# Altium schematic sheet 1_PD 20V 5A.schdoc
size 307 x 218 mm; Symbol: Drawing-Symbol_A4; Device: Drawing-Symbol_A4; @Project Name: PowerManagement Board for Rpi; @Page Count: 1; @Update Date: 2025-02-01; @Create Date: 2024-12-30; @Schematic Name: Rpi Head; @Page No: 1; @Page Name: PD 20V 5A; Company: EasyEDA.com; Version: V1.0; Page Size: A4; @Create Time: 21:08:13; @Update Time: 23:17:41; Width: 1170; Height: 825; Region Start: 1; X Region Count: 6; Y Region Count: 4; Blade Width: 10; Title Block Position: 3; @Board Name: Board1
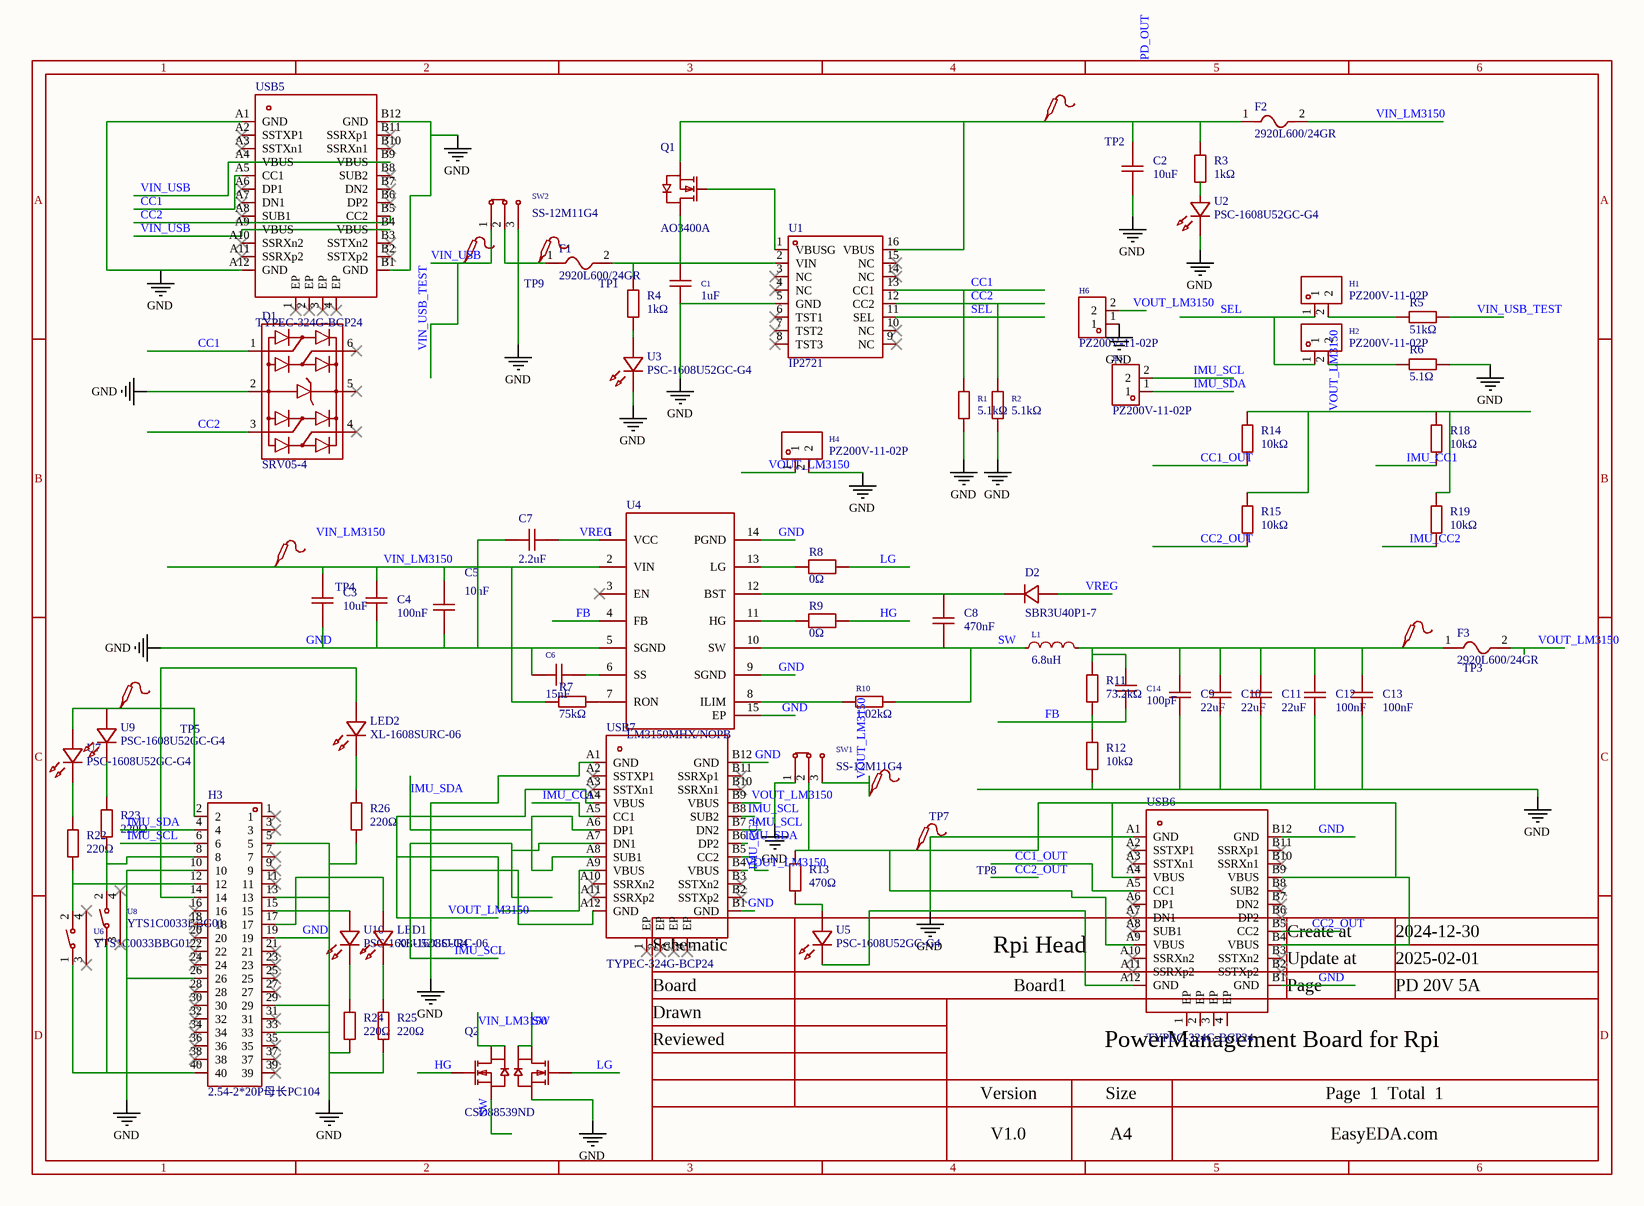
[diagram p0: 1_PD 20V 5A.schdoc]

## Parts
C1  1uF  [C0805]
C2  10uF  [C0805]
C3  10uF  [C0805]
C4  100nF  [C0603]
C5  10nF  [C0603]
C6  15nF  [C0603]
C7  2.2uF  [C0603]
C8  470nF  [C0603]
C9  22uF  [C0805]
C10  22uF  [C0805]
C11  22uF  [C0805]
C12  100nF  [C0805]
C13  100nF  [C0805]
C14  100pF  [C0805]
D1  SRV05-4  [SOT-23-6_L2.9-W1.6-P0.95-LS2.8-BL]
D2  SBR3U40P1-7  [POWERDI-123_L2.8-W1.8-LS3.7-RD]
F1  2920L600/24GR  [F2920]
F2  2920L600/24GR  [F2920]
F3  2920L600/24GR  [F2920]
H1  PZ200V-11-02P  [HDR-TH_2P-P2.00-V-M]
H2  PZ200V-11-02P  [HDR-TH_2P-P2.00-V-M]
H3  2.54-2*20P母长PC104  [HDR-TH_40P-P2.54-V-F-R2-C20-S2.54-2]
H4  PZ200V-11-02P  [HDR-TH_2P-P2.00-V-M]
H5  PZ200V-11-02P  [HDR-TH_2P-P2.00-V-M]
H6  PZ200V-11-02P  [HDR-TH_2P-P2.00-V-M]
L1  6.8uH  [IND-SMD_L11.5-W10.0]
LED1  XL-1608SURC-06  [LED0603-RD_RED]
LED2  XL-1608SURC-06  [LED0603-RD_RED]
Q1  AO3400A  [SOT-23-3_L2.9-W1.3-P1.90-LS2.4-BR]
Q2  CSD88539ND  [SOIC-8_L4.9-W3.9-P1.27-LS6.2-BL]
R1  5.1kΩ  [R0603]
R2  5.1kΩ  [R0603]
R3  1kΩ  [R0603]
R4  1kΩ  [R0603]
R5  51kΩ  [R0603]
R6  5.1Ω  [R0603]
R7  75kΩ  [R0603]
R8  0Ω  [R0603]
R9  0Ω  [R0603]
R10  1.02kΩ  [R0603]
R11  73.2kΩ  [R0603]
R12  10kΩ  [R0603]
R13  470Ω  [R0603]
R14  10kΩ  [R0603]
R15  10kΩ  [R0603]
R18  10kΩ  [R0603]
R19  10kΩ  [R0603]
R22  220Ω  [R0603]
R23  220Ω  [R0603]
R24  220Ω  [R0603]
R25  220Ω  [R0603]
R26  220Ω  [R0603]
SW1  SS-12M11G4  [SW-TH_XKB_SS-12M11XX]
SW2  SS-12M11G4  [SW-TH_XKB_SS-12M11XX]
TP1  (no value)  [Test-Point-0.5mm]
TP2  (no value)  [Test-Point-0.5mm]
TP3  (no value)  [Test-Point-0.5mm]
TP4  (no value)  [Test-Point-0.5mm]
TP5  (no value)  [Test-Point-0.5mm]
TP7  (no value)  [Test-Point-0.5mm]
TP8  (no value)  [Test-Point-0.5mm]
TP9  (no value)  [Test-Point-0.5mm]
U1  IP2721  [TSSOP-16_L5.0-W4.4-P0.65-LS6.4-BL]
U2  PSC-1608U52GC-G4  [LED0603-RD_GREEN]
U3  PSC-1608U52GC-G4  [LED0603-RD_GREEN]
U4  LM3150MHX/NOPB  [HTSSOP-14_L5.0-W4.4-P0.65-LS6.4-BL-EP]
U5  PSC-1608U52GC-G4  [LED0603-RD_GREEN]
U6  YTS1C0033BBG01  [SW-SMD_YIYUAN_YTS1C003XXX]
U7  PSC-1608U52GC-G4  [LED0603-RD_GREEN]
U8  YTS1C0033BBG01  [SW-SMD_YIYUAN_YTS1C003XXX]
U9  PSC-1608U52GC-G4  [LED0603-RD_GREEN]
U10  PSC-1608U52GC-G4  [LED0603-RD_GREEN]
USB5  TYPEC-324G-BCP24  [USB-C-SMD_TYPEC-324G-BCP24]
USB6  TYPEC-324G-BCP24  [USB-C-SMD_TYPEC-324G-BCP24]
USB7  TYPEC-324G-BCP24  [USB-C-SMD_TYPEC-324G-BCP24]

## Nets
GND: C1.1 C2.1 C3.1 C4.1 C5.1 C6.1 C7.1 C9.1 C10.1 C11.1 C12.1 C13.1 D1.2 H3.5 H3.10 H3.13 H3.19 H3.26 H3.29 H3.33 H3.40 H4.2 H6.1 Q2.3(S) R1.1 R2.1 R6.2 R12.1 R24.1 R25.1 R26.1 SW1.1 SW2.3 U1.5(GND) U2.1(K) U3.1(K) U4.5(SGND) U4.9(SGND) U4.14(PGND) U4.15(EP) U5.1(K) U6.1 U8.1 USB5.A1(GND) USB5.A12(GND) USB5.B1(GND) USB5.B12(GND) USB6.A1(GND) USB6.A12(GND) USB6.B1(GND) USB6.B12(GND) USB7.A1(GND) USB7.A12(GND) USB7.B1(GND) USB7.B12(GND)
CC1: D1.1 R1.2 U1.13(CC1) USB5.A5(CC1)
CC1_OUT: R14.1 USB6.A5(CC1)
CC2: D1.3 R2.2 U1.12(CC2) USB5.B5(CC2)
CC2_OUT: R15.1 USB6.B5(CC2)
FB: C14.1 R11.1 R12.2 U4.4(FB)
HG: Q2.2(G) R9.2
IMU_CC1: R18.1 USB7.A5(CC1)
IMU_CC2: R19.1 USB7.B5(CC2)
IMU_SCL: H3.6 H5.2 USB7.A7(DN1) USB7.B7(DN2) USB7.B8(SUB2)
IMU_SDA: H3.4 H5.1 USB7.A6(DP1) USB7.A8(SUB1) USB7.B6(DP2)
LG: Q2.4(G) R8.2
SEL: H1.1 H2.1 U1.11(SEL)
SW: C8.1 L1.1 Q2.1(S) Q2.5(D) Q2.6(D) R10.2 U4.10(SW)
VIN_LM3150: C3.2 C4.2 C5.2 F2.2 Q2.7(D) Q2.8(D) R7.1 TP4.1 U4.2(VIN)
VIN_USB: R5.2 SW2.1 TP9.1 USB5.A4(VBUS) USB5.A9(VBUS) USB5.B4(VBUS) USB5.B9(VBUS)  [also labelled VIN_USB_TEST]
VOUT_LM3150: F3.2 H4.1 H6.2 R14.2 R15.2 R18.2 R19.2 SW1.3 TP7.1 USB7.A4(VBUS) USB7.A9(VBUS) USB7.B4(VBUS) USB7.B9(VBUS)
VREG: C7.2 D2.2(A) U4.1(VCC)
NetC1_2: C1.2 F1.2 Q1.3(D) R4.2 U1.2(VIN)
NetC2_2: C2.2 F2.1 Q1.2(S) R3.2 TP2.1 U1.16(VBUS)
NetC6_2: C6.2 U4.6(SS)
NetC8_2: C8.2 D2.1(C) U4.12(BST)
NetC9_2: C9.2 C10.2 C11.2 C12.2 C13.2 C14.2 F3.1 L1.2 R11.2 TP3.1
NetF1_1: F1.1 SW2.2 TP1.1
NetH1_2: H1.2 R5.1
NetH2_2: H2.2 R6.1
NetH3_2: H3.2 TP5.1 U7.2(A) U9.2(A)
NetH3_8: H3.8 R23.1 U8.2
NetH3_12: H3.12 R22.1 U6.2
NetH3_14: H3.14 LED2.2(A)
NetH3_15: H3.15 U10.2(A)
NetH3_17: H3.17 LED1.2(A)
NetLED1_1: LED1.1(K) R25.2
NetLED2_1: LED2.1(K) R26.2
NetQ1_1: Q1.1(G) U1.1(VBUSG)
NetR3_1: R3.1 U2.2(A)
NetR4_1: R4.1 U3.2(A)
NetR7_2: R7.2 U4.7(RON)
NetR8_1: R8.1 U4.13(LG)
NetR9_1: R9.1 U4.11(HG)
NetR10_1: R10.1 U4.8(ILIM)
NetR13_1: R13.1 U5.2(A)
NetR13_2: R13.2 SW1.2 TP8.1 USB6.A4(VBUS) USB6.A9(VBUS) USB6.B4(VBUS) USB6.B9(VBUS)
NetR22_2: R22.2 U7.1(K)
NetR23_2: R23.2 U9.1(K)
NetR24_2: R24.2 U10.1(K)

Not connected (* = marked no-connect by the designer): D1 4* 5* 6*; H3 1* 3* 7* 9* 11* 16* 18* 20* 21* 22* 23* 24* 25* 27* 28* 30* 31* 32* 34* 35* 36* 37* 38* 39*; U1 3(NC)* 4(NC)* 6(TST1)* 7(TST2)* 8(TST3)* 9(NC)* 10(NC)* 14(NC)* 15(NC)*; U4 3(EN)*; U6 3* 4*; U8 3* 4*; USB5 1(EP)* 2(EP)* 3(EP)* 4(EP)* A2(SSTXP1)* A3(SSTXn1)* A6(DP1)* A7(DN1)* A8(SUB1)* A10(SSRXn2)* A11(SSRXp2)* B2(SSTXp2)* B3(SSTXn2)* B6(DP2)* B7(DN2)* B8(SUB2)* B10(SSRXn1)* B11(SSRXp1)*; USB6 1(EP) 2(EP) 3(EP) 4(EP) A2(SSTXP1)* A3(SSTXn1)* A6(DP1)* A7(DN1)* A8(SUB1)* A10(SSRXn2)* A11(SSRXp2)* B2(SSTXp2)* B3(SSTXn2)* B6(DP2)* B7(DN2)* B8(SUB2)* B10(SSRXn1)* B11(SSRXp1)*; USB7 1(EP)* 2(EP)* 3(EP)* 4(EP)* A2(SSTXP1)* A3(SSTXn1)* A10(SSRXn2)* A11(SSRXp2)* B2(SSTXp2)* B3(SSTXn2)* B10(SSRXn1)* B11(SSRXp1)*

## Notes on the sheet
- Labels drawn without touching a wire or pin: PD_OUT, VIN_LM3150
- 1
- 2
- 3
- 4
- 5
- 6
- A
- B
- C
- Schematic
- Rpi Head
- Create at
- Update at
- 2024-12-30
- 2025-02-01
- Board
- Drawn
- Board1
- Page
- PD 20V 5A
- D
- Reviewed
- Version
- Size
- PowerManagement Board for Rpi
- Page  1  Total  1
- V1.0
- A4
- EasyEDA.com

## Library data of the parts
C1 = CL21B105KBFNNNE: Manufacturer: SAMSUNG(三星); Add into BOM: yes; Tolerance: ±10%; Symbol: CL21B105KBFNNNE; Device: CL21B105KBFNNNE; Supplier: LCSC; Manufacturer Part: CL21B105KBFNNNE; Value: 1uF; Supplier Part: C28323; JLCPCB Part Class: Basic Part; LCSC Part Name: 1uF ±10% 50V; Supplier Footprint: 0805; Datasheet: https://atta.szlcsc.com/upload/public/pdf/source/20160218/1457707763339.pdf; Convert to PCB: yes
C2 C3 = CL21A106KBYQNNE: Manufacturer: SAMSUNG(三星); Add into BOM: yes; Tolerance: ±10%; Symbol: CL21A106KBYQNNE; Device: CL21A106KBYQNNE; LCSC Part Name: 10uF ±10% 50V; Supplier Part: C2932476; Manufacturer Part: CL21A106KBYQNNE; Supplier Footprint: 0805; JLCPCB Part Class: Extended Part; Datasheet: https://atta.szlcsc.com/upload/public/pdf/source/20211217/EA547804C3DC63CB0E92325AB8B6CF61.pdf; Supplier: LCSC; Convert to PCB: yes; Value: 10uF
C4 = CT41G-0603-2X1-50V-0.1μF-K(N): Manufacturer: TORCH(火炬); Add into BOM: yes; Tolerance: ±10%; Symbol: CT41G-0603-2X1-50V-0.1μF-K(N); Device: CT41G-0603-2X1-50V-0.1μF-K(N); LCSC Part Name: 100nF ±10% 50V; Supplier Part: C125205; Manufacturer Part: CT41G-0603-2X1-50V-0.1μF-K(N); Supplier Footprint: 0603; JLCPCB Part Class: Extended Part; Datasheet: https://atta.szlcsc.com/upload/public/pdf/source/20171225/C150708_15141883600121203188.pdf; Supplier: LCSC; Convert to PCB: yes; Value: 100nF
C5 = CT41G-0603-2X1-50V-0.01μF-K(N): Manufacturer: TORCH(火炬); Symbol: CT41G-0603-2X1-50V-0.01UF-K(N); Add into BOM: yes; Tolerance: ±10%; Device: CT41G-0603-2X1-50V-0.01μF-K(N); LCSC Part Name: 10nF ±10% 50V; Supplier Part: C136131; Manufacturer Part: CT41G-0603-2X1-50V-0.01μF-K(N); Supplier Footprint: 0603; JLCPCB Part Class: Extended Part; Datasheet: https://atta.szlcsc.com/upload/public/pdf/source/20180104/C136131_15150388659201227415.pdf; Supplier: LCSC; Convert to PCB: yes; Value: 10nF
C6 = CC0603JRX7R9BB153: Manufacturer: YAGEO(国巨); Add into BOM: yes; Tolerance: ±5%; Symbol: CC0603JRX7R9BB153; Device: CC0603JRX7R9BB153; Supplier: LCSC; Supplier Part: C519550; Manufacturer Part: CC0603JRX7R9BB153; Value: 15nF; JLCPCB Part Class: Extended Part; LCSC Part Name: 15nF ±5% 50V; Supplier Footprint: 0603; Datasheet: https://atta.szlcsc.com/upload/public/pdf/source/20200423/C519550_A1941788CCD45C6ADF0AD0CE4A47CC49.pdf; Convert to PCB: yes
C7 = CL10A225KA8NNNC: Manufacturer: SAMSUNG(三星); Add into BOM: yes; Tolerance: ±10%; Symbol: CL10A225KA8NNNC; Device: CL10A225KA8NNNC; LCSC Part Name: 2.2uF ±10% 25V; Supplier Part: C57895; Manufacturer Part: CL10A225KA8NNNC; Supplier Footprint: 0603; JLCPCB Part Class: Extended Part; Datasheet: https://atta.szlcsc.com/upload/public/pdf/source/20160218/1457707763339.pdf; Supplier: LCSC; Convert to PCB: yes; Value: 2.2uF
C8 = CC0603KRX5R9BB474: Manufacturer: YAGEO(国巨); Add into BOM: yes; Tolerance: ±10%; Symbol: CC0603KRX5R9BB474; Device: CC0603KRX5R9BB474; LCSC Part Name: 470nF ±10% 50V; Supplier Part: C513651; Manufacturer Part: CC0603KRX5R9BB474; Supplier Footprint: 0603; JLCPCB Part Class: Extended Part; Datasheet: https://atta.szlcsc.com/upload/public/pdf/source/20220307/83F6E042A9E546CE59B11E74A9B4F458.pdf; Supplier: LCSC; Convert to PCB: yes; Value: 470nF
C9-C11 = CL21A226MPQNNNE: Manufacturer: SAMSUNG(三星); Add into BOM: yes; Tolerance: ±20%; Symbol: CL21A226MPQNNNE; Device: CL21A226MPQNNNE; LCSC Part Name: 22uF ±20% 10V; Supplier Part: C29277; Manufacturer Part: CL21A226MPQNNNE; Supplier Footprint: 0805; JLCPCB Part Class: Extended Part; Datasheet: https://atta.szlcsc.com/upload/public/pdf/source/20160218/1457707763339.pdf; Supplier: LCSC; Convert to PCB: yes; Value: 22uF
C12 C13 = CL21B104KBCNNNC: Manufacturer: SAMSUNG(三星); Add into BOM: yes; Tolerance: ±10%; Symbol: CL21B104KBCNNNC; Device: CL21B104KBCNNNC; LCSC Part Name: 100nF ±10% 50V; Supplier Part: C1711; Manufacturer Part: CL21B104KBCNNNC; Supplier Footprint: 0805; JLCPCB Part Class: Extended Part; Datasheet: https://atta.szlcsc.com/upload/public/pdf/source/20160218/1457707763339.pdf; Supplier: LCSC; Convert to PCB: yes; Value: 100nF
C14 = CL21C101JBANNNC: Manufacturer: SAMSUNG(三星); Add into BOM: yes; Tolerance: ±5%; Symbol: CL21C101JBANNNC; Device: CL21C101JBANNNC; Supplier: LCSC; Manufacturer Part: CL21C101JBANNNC; Value: 100pF; Supplier Part: C1790; JLCPCB Part Class: Basic Part; LCSC Part Name: 100pF ±5% 50V; Supplier Footprint: 0805; Datasheet: https://atta.szlcsc.com/upload/public/pdf/source/20160218/1457707763339.pdf; Convert to PCB: yes
D1 = SRV05-4_C558418: Manufacturer: TECH PUBLIC(台舟); Add into BOM: yes; polarity: Unidirectional; Reverse Stand-Off Voltage (Vrwm): 5V; Maximum Clamping Voltage: 20V; Peak Pulse Current (Ipp): 3A; Peak Pulse Power Dissipation (Ppp): 60W; Breakdown Voltage: 6V; Reverse Leakage Current (Ir): 500nA; Number of Lines: Four channels; level of protection: IEC 61000-4-2; Type: ESD; Symbol: SRV05-4_C558418; Device: SRV05-4_C558418; LCSC Part Name: ESD，可防25kV静电; Supplier Part: C558418; Manufacturer Part: SRV05-4; Supplier Footprint: SOT-23-6; JLCPCB Part Class: Extended Part; Datasheet: https://atta.szlcsc.com/upload/public/pdf/source/20230615/CFFDFFE99FDA0E92DF9600783B3A2A20.pdf; Supplier: LCSC; Convert to PCB: yes; Operating Temperature: -55℃~+125℃
D2 = SBR3U40P1-7: Manufacturer: DIODES(美台); Add into BOM: yes; Forward Voltage (Vf) @ If: 420mV@3A; Reverse Leakage Current: 70uA@40V; Symbol: SBR3U40P1-7; Device: SBR3U40P1-7; LCSC Part Name: 电压:40V 电流:3A; Supplier Part: C97127; Manufacturer Part: SBR3U40P1-7; Supplier Footprint: PowerDI-123; JLCPCB Part Class: Extended Part; Datasheet: https://atta.szlcsc.com/upload/public/pdf/source/20170515/1494827298440.pdf; Supplier: LCSC; Convert to PCB: yes
F1-F3 = 2920L600/24GR: Manufacturer: LUTE(陆特); Add into BOM: yes; Operating Voltage (Max): 24V; Current Rating (Max): 40A; Hold Current: 6A; Trip Current: 12A; Power Dissipation: 2.5W; Resistance - Initial (Ri) (Min): 4mΩ; Resistance - Post Trip (R1) (Max): 20mΩ; Maximum Time to Trip: 6s; Symbol: 2920L600/24GR; Device: 2920L600/24GR; LCSC Part Name: 2920L600/24GR; Supplier Part: C20627125; Manufacturer Part: 2920L600/24GR; Supplier Footprint: 2920; JLCPCB Part Class: Extended Part; Datasheet: https://atta.szlcsc.com/upload/public/pdf/source/20240229/1CCB97D8CAD2CD14FF2A73F12A124A77.pdf; Supplier: LCSC; Convert to PCB: yes; Operating Temperature: -40℃~+85℃
H1 H2 H4-H6 = PZ200V-11-02P: Manufacturer: XFCN(兴飞); Add into BOM: yes; Pin Structure: 1x2P; Pitch: 2mm; Circluar Pins/Square Pins: Square Pins; Symbol: PZ200V-11-02P; Device: PZ200V-11-02P; Supplier: LCSC; Supplier Part: C541856; Manufacturer Part: PZ200V-11-02P; JLCPCB Part Class: Extended Part; LCSC Part Name: 间距:2mm 1x2P 直插 方针; Supplier Footprint: 插件,P=2mm; Datasheet: https://atta.szlcsc.com/upload/public/pdf/source/20200518/C541858_7610F54454E936EFCDE06B655DF7C837.pdf; Convert to PCB: yes; Row Spacing: -; Mounting Type: Straight; Number of Rows: Plugin; Number of Pins: 2P; Current Rating (Max): -; Voltage Rating (Max): -; Length of Mating Pin: 3.9mm; Insulation Height: 2mm; Length of End Connection Pin: 2.8mm; Contact Plating: -; Operating Temperature Range: -40℃~+105℃; Soldering Temperature(Max): -; Color: Black
H3 = 2.54-2*20P母长PC104: Manufacturer: BOOMELE(博穆精密); Symbol: 2.54mm 2*20P; Add into BOM: yes; Holes Structure: 2x20P; Pitch: 2.54mm; Number of Holes: 40P; Device: 2.54-2*20P母长PC104; LCSC Part Name: 间距:2.54mm 2x20P 直插; Supplier Part: C35165; Manufacturer Part: 2.54-2*20P母长PC104; Supplier Footprint: 插件,P=2.54mm; JLCPCB Part Class: Extended Part; Datasheet: https://atta.szlcsc.com/upload/public/pdf/source/20151109/1457707557259.pdf; Supplier: LCSC; Convert to PCB: yes; Row Spacing: 2.54mm; Mounting Type: Straight; Number of Rows: 双排; Insulation Height: -; Contact Material: Brass; Contact Plating: -
L1 = SMMS1050-6R8M: Manufacturer: SXN(顺翔诺); Add into BOM: yes; Tolerance: ±20%; Saturation Current (Isat): 13A; Type: 一体成型电感; Symbol: SMMS1050-6R8M; Device: SMMS1050-6R8M; Supplier: LCSC; Manufacturer Part: SMMS1050-6R8M; Value: 6.8uH; Supplier Part: C149542; JLCPCB Part Class: Extended Part; LCSC Part Name: 6.8uH ±20% 13A; Supplier Footprint: SMD; Datasheet: https://atta.szlcsc.com/upload/public/pdf/source/20210810/BBF24330FB2F5029F637830BA9C42C0D.pdf; Convert to PCB: yes
LED1 LED2 = XL-1608SURC-06: Manufacturer: XINGLIGHT(成兴光); Add into BOM: yes; Emitted Color: Red; Power Dissipation: 55mW; Forward Current: 25mA; Dominant Wavelength: 617nm~621nm; Peak Wavelength: 623nm; Lens Color: 无色透明透镜; Viewing Angle: 120°; Mounting Sytle: Positive post; Symbol: XL-1608SURC-06; Device: XL-1608SURC-06; LCSC Part Name: XL-1608SURC-06; Supplier Part: C965799; Manufacturer Part: XL-1608SURC-06; Supplier Footprint: 0603; JLCPCB Part Class: Extended Part; Datasheet: https://atta.szlcsc.com/upload/public/pdf/source/20221102/D860AFDD1CDB02C5A8064103A32707E2.pdf; Supplier: LCSC; Convert to PCB: yes; Color Temperature: -; Operating Temperature: -30℃~+85℃
Q1 = AO3400A_C347475: Manufacturer: UMW(友台半导体); Add into BOM: yes; Type: 1 N-Channel; Drain Source On Resistance (RDS(on)@Vgs,Id): 28mΩ@10V,5.8A; Gate Threshold Voltage (Vgs(th)@Id): 1.4V@250uA; Total Gate Charge (Qg@Vgs): 12nC@10V; Input Capacitance (Ciss@Vds): 1050pF@24V; Reverse Transfer Capacitance (Crss@Vds): 77pF@15V; Symbol: AO3400A_C347475; Device: AO3400A_C347475; LCSC Part Name: 1个N沟道 耐压:30V 电流:5.8A; Supplier Part: C347475; Manufacturer Part: AO3400A; Supplier Footprint: SOT-23; JLCPCB Part Class: Extended Part; Datasheet: https://atta.szlcsc.com/upload/public/pdf/source/20231109/50AB4FB4D66E55864F9B8D027B723C9A.pdf; Supplier: LCSC; Convert to PCB: yes; Operating Temperature: -55℃~+150℃
Q2 = CSD88539ND: Manufacturer: TI(德州仪器); Add into BOM: yes; Type: 2 N-Channel; Drain Source Voltage (Vdss): 60V; Drain Source On Resistance (RDS(on)@Vgs,Id): 27mΩ@6V,5A; Gate Threshold Voltage (Vgs(th)@Id): 3V@250uA; Total Gate Charge (Qg@Vgs): 9.4nC@10V; Input Capacitance (Ciss@Vds): 741pF@30V; Reverse Transfer Capacitance (Crss@Vds): 2.6pF@30V; Symbol: CSD88539ND; Device: CSD88539ND; LCSC Part Name: 2个N沟道 耐压:60V 电流:11.7A; Supplier Part: C2867030; Manufacturer Part: CSD88539ND; Supplier Footprint: SOIC-8; JLCPCB Part Class: Extended Part; Datasheet: https://www.ti.com/cn/lit/gpn/csd88539nd; Supplier: LCSC; Convert to PCB: yes; Operating Temperature: -55℃~+150℃
R1 R2 = RTT035101BTP: Manufacturer: RALEC(旺诠); Add into BOM: yes; Tolerance: ±0.1%; Temperature Coefficient: ±100ppm/℃; Symbol: RTT035101BTP; Device: RTT035101BTP; Supplier: LCSC; Supplier Part: C312257; Manufacturer Part: RTT035101BTP; Value: 5.1kΩ; JLCPCB Part Class: Extended Part; LCSC Part Name: 厚膜电阻 5.1kΩ ±0.1% 100mW; Supplier Footprint: 0603; Datasheet: https://atta.szlcsc.com/upload/public/pdf/source/20191219/C158410_884373A5B7E1BC76BF57BC45A946C093.pdf; Convert to PCB: yes; Type: Thick Film Resistors; Operating Temperature Range: -55℃~+155℃
R3 R4 = 0603WAF1001T5E: Manufacturer: UNI-ROYAL(厚声); Add into BOM: yes; Tolerance: ±1%; Temperature Coefficient: ±100ppm/℃; Symbol: 0603WAF1001T5E; Device: 0603WAF1001T5E; LCSC Part Name: 1kΩ ±1% 100mW 厚膜电阻; Supplier Part: C21190; Manufacturer Part: 0603WAF1001T5E; Supplier Footprint: 0603; JLCPCB Part Class: Basic Part; Datasheet: https://atta.szlcsc.com/upload/public/pdf/source/20200306/C422600_1E6D84923E4A46A82E41ADD87F860B5C.pdf; Supplier: LCSC; Convert to PCB: yes; Type: Thick Film Resistors; Value: 1kΩ; Operating Temperature Range: -55℃~+155℃
R5 = RC0603FR-0751KL: Manufacturer: YAGEO(国巨); Add into BOM: yes; Tolerance: ±1%; Temperature Coefficient: ±100ppm/℃; Symbol: RC0603FR-0751KL; Device: RC0603FR-0751KL; LCSC Part Name: 厚膜电阻 51kΩ ±1% 100mW; Supplier Part: C107231; Manufacturer Part: RC0603FR-0751KL; Supplier Footprint: 0603; JLCPCB Part Class: Extended Part; Datasheet: https://atta.szlcsc.com/upload/public/pdf/source/20180821/C275644_0D56F95EFF785E7D9A1FEF436B37DA78.pdf; Supplier: LCSC; Convert to PCB: yes; Type: Thick Film Resistors; Value: 51kΩ; Operating Temperature Range: -55℃~+155℃
R6 = RC0603FR-075R1L: Manufacturer: YAGEO(国巨); Add into BOM: yes; Tolerance: ±1%; Temperature Coefficient: ±200ppm/℃; Symbol: RC0603FR-075R1L; Device: RC0603FR-075R1L; LCSC Part Name: 厚膜电阻 5.1Ω ±1% 100mW; Supplier Part: C114626; Manufacturer Part: RC0603FR-075R1L; Supplier Footprint: 0603; JLCPCB Part Class: Extended Part; Datasheet: https://atta.szlcsc.com/upload/public/pdf/source/20180821/C275644_0D56F95EFF785E7D9A1FEF436B37DA78.pdf; Supplier: LCSC; Convert to PCB: yes; Type: Thick Film Resistors; Value: 5.1Ω; Operating Temperature Range: -55℃~+155℃
R7 = RC0603FR-0775KL: Manufacturer: YAGEO(国巨); Add into BOM: yes; Tolerance: ±1%; Temperature Coefficient: ±100ppm/℃; Symbol: RC0603FR-0775KL; Device: RC0603FR-0775KL; LCSC Part Name: 厚膜电阻 75kΩ ±1% 100mW; Supplier Part: C114636; Manufacturer Part: RC0603FR-0775KL; Supplier Footprint: 0603; JLCPCB Part Class: Extended Part; Datasheet: https://atta.szlcsc.com/upload/public/pdf/source/20180821/C275644_0D56F95EFF785E7D9A1FEF436B37DA78.pdf; Supplier: LCSC; Convert to PCB: yes; Type: Thick Film Resistors; Value: 75kΩ; Operating Temperature Range: -55℃~+155℃
R8 R9 = FRC0603F0000TS: Manufacturer: FOJAN(富捷); Add into BOM: yes; Tolerance: ±1%; Symbol: FRC0603F0000TS; Device: FRC0603F0000TS; LCSC Part Name: 0Ω ±1% 100mW 厚膜电阻; Supplier Part: C2906974; Manufacturer Part: FRC0603F0000TS; Supplier Footprint: 0603; JLCPCB Part Class: Extended Part; Datasheet: https://atta.szlcsc.com/upload/public/pdf/source/20211221/925EC7D7225764EE0046F22065062C87.pdf; Supplier: LCSC; Convert to PCB: yes; Type: Thick Film Resistors; Value: 0Ω; Operating Temperature Range: -55℃~+155℃
R10 = 0603WAF1021T5E: Manufacturer: UNI-ROYAL(厚声); Add into BOM: yes; Tolerance: ±1%; Temperature Coefficient: ±100ppm/℃; Symbol: 0603WAF1021T5E; Device: 0603WAF1021T5E; Supplier: LCSC; Manufacturer Part: 0603WAF1021T5E; Supplier Part: C22831; Value: 1.02kΩ; JLCPCB Part Class: Extended Part; LCSC Part Name: 1.02kΩ ±1% 100mW 厚膜电阻; Supplier Footprint: 0603; Datasheet: https://atta.szlcsc.com/upload/public/pdf/source/20200306/C422600_1E6D84923E4A46A82E41ADD87F860B5C.pdf; Convert to PCB: yes; Type: Thick Film Resistors; Operating Temperature Range: -55℃~+155℃
R11 = RC0603FR-0773K2L: Manufacturer: YAGEO(国巨); Add into BOM: yes; Tolerance: ±1%; Temperature Coefficient: ±100ppm/℃; Symbol: RC0603FR-0773K2L; Device: RC0603FR-0773K2L; LCSC Part Name: 厚膜电阻 73.2kΩ ±1% 100mW; Supplier Part: C163420; Manufacturer Part: RC0603FR-0773K2L; Supplier Footprint: 0603; JLCPCB Part Class: Extended Part; Datasheet: https://atta.szlcsc.com/upload/public/pdf/source/20181009/C309620_DA5935B6E1D48212CB7A533FE518B3C2.pdf; Supplier: LCSC; Convert to PCB: yes; Type: Thick Film Resistors; Value: 73.2kΩ; Operating Temperature Range: -55℃~+155℃
R12 R14 R15 R18 R19 = RC0603FR-0710KL: Manufacturer: YAGEO(国巨); Add into BOM: yes; Tolerance: ±1%; Temperature Coefficient: ±100ppm/℃; Symbol: RC0603FR-0710KL; Device: RC0603FR-0710KL; LCSC Part Name: 厚膜电阻 10kΩ ±1% 100mW; Supplier Part: C98220; Manufacturer Part: RC0603FR-0710KL; Supplier Footprint: 0603; JLCPCB Part Class: Extended Part; Datasheet: https://atta.szlcsc.com/upload/public/pdf/source/20180927/C295883_E8D83085EA81BD7DE0B2B681138C15EE.pdf; Supplier: LCSC; Convert to PCB: yes; Type: Thick Film Resistors; Value: 10kΩ; Operating Temperature Range: -55℃~+155℃
R13 = RC0603FR-07470RL: Manufacturer: YAGEO(国巨); Add into BOM: yes; Tolerance: ±1%; Temperature Coefficient: ±100ppm/℃; Symbol: RC0603FR-07470RL; Device: RC0603FR-07470RL; LCSC Part Name: 厚膜电阻 470Ω ±1% 100mW; Supplier Part: C114669; Manufacturer Part: RC0603FR-07470RL; Supplier Footprint: 0603; JLCPCB Part Class: Extended Part; Datasheet: https://atta.szlcsc.com/upload/public/pdf/source/20180821/C275644_0D56F95EFF785E7D9A1FEF436B37DA78.pdf; Supplier: LCSC; Convert to PCB: yes; Type: Thick Film Resistors; Value: 470Ω; Operating Temperature Range: -55℃~+155℃
R22-R26 = RC0603FR-07220RL: Manufacturer: YAGEO(国巨); Add into BOM: yes; Tolerance: ±1%; Temperature Coefficient: ±100ppm/℃; Symbol: RC0603FR-07220RL; Device: RC0603FR-07220RL; LCSC Part Name: 厚膜电阻 220Ω ±1% 100mW; Supplier Part: C107696; Manufacturer Part: RC0603FR-07220RL; Supplier Footprint: 0603; JLCPCB Part Class: Extended Part; Datasheet: https://atta.szlcsc.com/upload/public/pdf/source/20180821/C275644_0D56F95EFF785E7D9A1FEF436B37DA78.pdf; Supplier: LCSC; Convert to PCB: yes; Type: Thick Film Resistors; Value: 220Ω; Operating Temperature Range: -55℃~+155℃
SW1 SW2 = SS-12M11G4: Manufacturer: XKB Connectivity(中国星坤); Add into BOM: yes; Circuit: SPDT; Actuator Style: Rectangular columnar; Pin Style: PCPin; Switch Length: 13mm; Switch Width: 7.2mm; Switch Height: 6.6mm; Actuator Color: Black; Current Rating (DC): 6A; Voltage Rating (DC): 120V; Mechanical Life: 1万次; Symbol: SS-12M11G4; Device: SS-12M11G4; Supplier: LCSC; Supplier Part: C2879840; Manufacturer Part: SS-12M11G4; JLCPCB Part Class: Extended Part; LCSC Part Name: 柄长4mm 直插双档 滑动开关; Supplier Footprint: 插件; Datasheet: https://atta.szlcsc.com/upload/public/pdf/source/20211009/04BB83002759118EAC16A9AC01596A50.pdf; Convert to PCB: yes; Mounting Style: Straight; Current Rating (AC): 6A; Voltage Rating (AC): 120V; Operating Temperature: -40℃~+85℃
TP1-TP5 TP7-TP9 = Test-Point: Add into BOM: yes; Symbol: Test-Point; Device: Test-Point; Convert to PCB: yes
U1 = IP2721: Manufacturer: INJOINIC(英集芯); Add into BOM: yes; Symbol: IP2721; Device: IP2721; LCSC Part Name: USB TYPEC/PD2.0/PD3.0物理层IC; Supplier Part: C603176; Manufacturer Part: IP2721; Supplier Footprint: TSSOP-16; JLCPCB Part Class: Extended Part; Datasheet: https://atta.szlcsc.com/upload/public/pdf/source/20200610/C603176_729C2C55A9E6451BDA9FCB913350E23E.pdf; Supplier: LCSC; Convert to PCB: yes; Operating Temperature: -40℃~+85℃
U2 U3 U5 U7 U9 U10 = PSC-1608U52GC-G4: Manufacturer: HONGLITRONIC(鸿利光电); Add into BOM: yes; Emitted Color: Green; Symbol: PSC-1608U52GC-G4; Device: PSC-1608U52GC-G4; LCSC Part Name: 钻孔1608低亮绿灯; Supplier Part: C22371297; Manufacturer Part: PSC-1608U52GC-G4; Supplier Footprint: 0603; JLCPCB Part Class: Extended Part; Datasheet: https://atta.szlcsc.com/upload/public/pdf/source/20240328/4E4686E4F5DB651C0553C7ABD92F986B.pdf; Supplier: LCSC; Convert to PCB: yes
U4 = LM3150MHX/NOPB: Manufacturer: TI(德州仪器); Add into BOM: yes; Function: Step-down type; Output Type: Adjustable; Input Voltage: 6V~42V; Output Voltage: 600mV~3.3V; Output Current: 12A; Switching Frequency: 500kHz; Number of Outputs: 1; Topology: Step-down; Switch tube (built-in/external): External; Symbol: LM3150MHX; Device: LM3150MHX/NOPB; LCSC Part Name: LM3150 宽输入电压同步降压控制器; Supplier Part: C48112; Manufacturer Part: LM3150MHX/NOPB; Supplier Footprint: HTSSOP-14-EP; JLCPCB Part Class: Extended Part; Datasheet: https://www.ti.com/cn/lit/gpn/lm3150; Supplier: LCSC; Convert to PCB: yes; Operating Temperature: -40℃~+125℃; Synchronous Rectification: Yes; Quiescent Current (Iq): -
U6 U8 = YTS1C0033BBG01: Manufacturer: YIYUAN(怡远); Add into BOM: yes; Symbol: YTS1C0033BBG01; Device: YTS1C0033BBG01; Supplier: LCSC; Supplier Part: C5188566; Manufacturer Part: YTS1C0033BBG01; JLCPCB Part Class: Extended Part; LCSC Part Name: 侧按键3x6x3.8 黑钮贴片; Supplier Footprint: SMD; Datasheet: https://atta.szlcsc.com/upload/public/pdf/source/20230613/7D2A610AF4C94741A450B980E2010797.pdf; Convert to PCB: yes
USB5-USB7 = TYPEC-324G-BCP24: Manufacturer: XUNPU(讯普); Add into BOM: yes; Connector Type: Type-C; Gender: Female; Number of Contacts: 24P; Number of Ports: 1; Current Rating - Power (Max): 5A; Symbol: TYPEC-324G-BCP24; Device: TYPEC-324G-BCP24; LCSC Part Name: Type-C 母 卧贴; Supplier Part: C920230; Manufacturer Part: TYPEC-324G-BCP24; Supplier Footprint: SMD; JLCPCB Part Class: Extended Part; Datasheet: https://atta.szlcsc.com/upload/public/pdf/source/20240730/570E6E6917F128F926C9CCEF1574B0B5.pdf; Supplier: LCSC; Convert to PCB: yes; Standard: USB 3.1; Mounting Style: Horizontal attachment; Operating Temperature Range: -45℃~+85℃